# Altium schematic sheet SynchronousBuck.SchDoc
size 500 x 299 mm; SheetNumber: 1; SheetTotal: 1
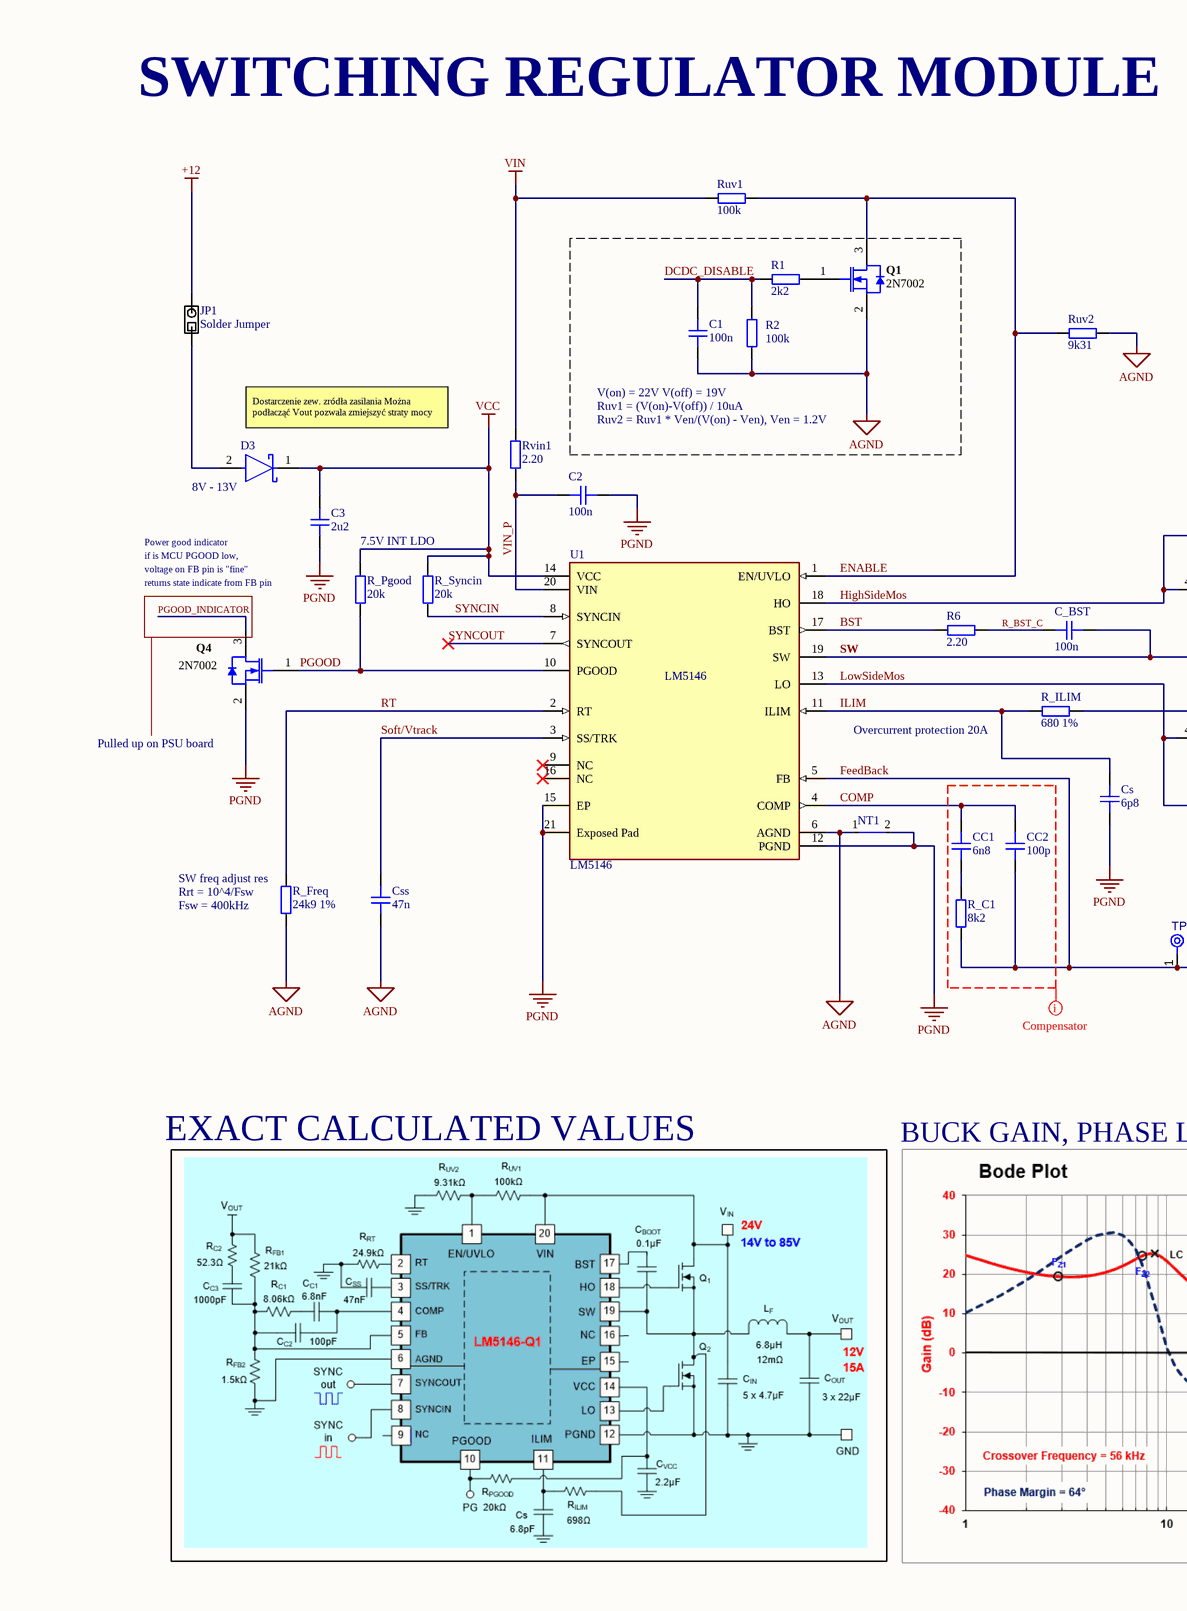
[diagram p0: SynchronousBuck.SchDoc, middle]
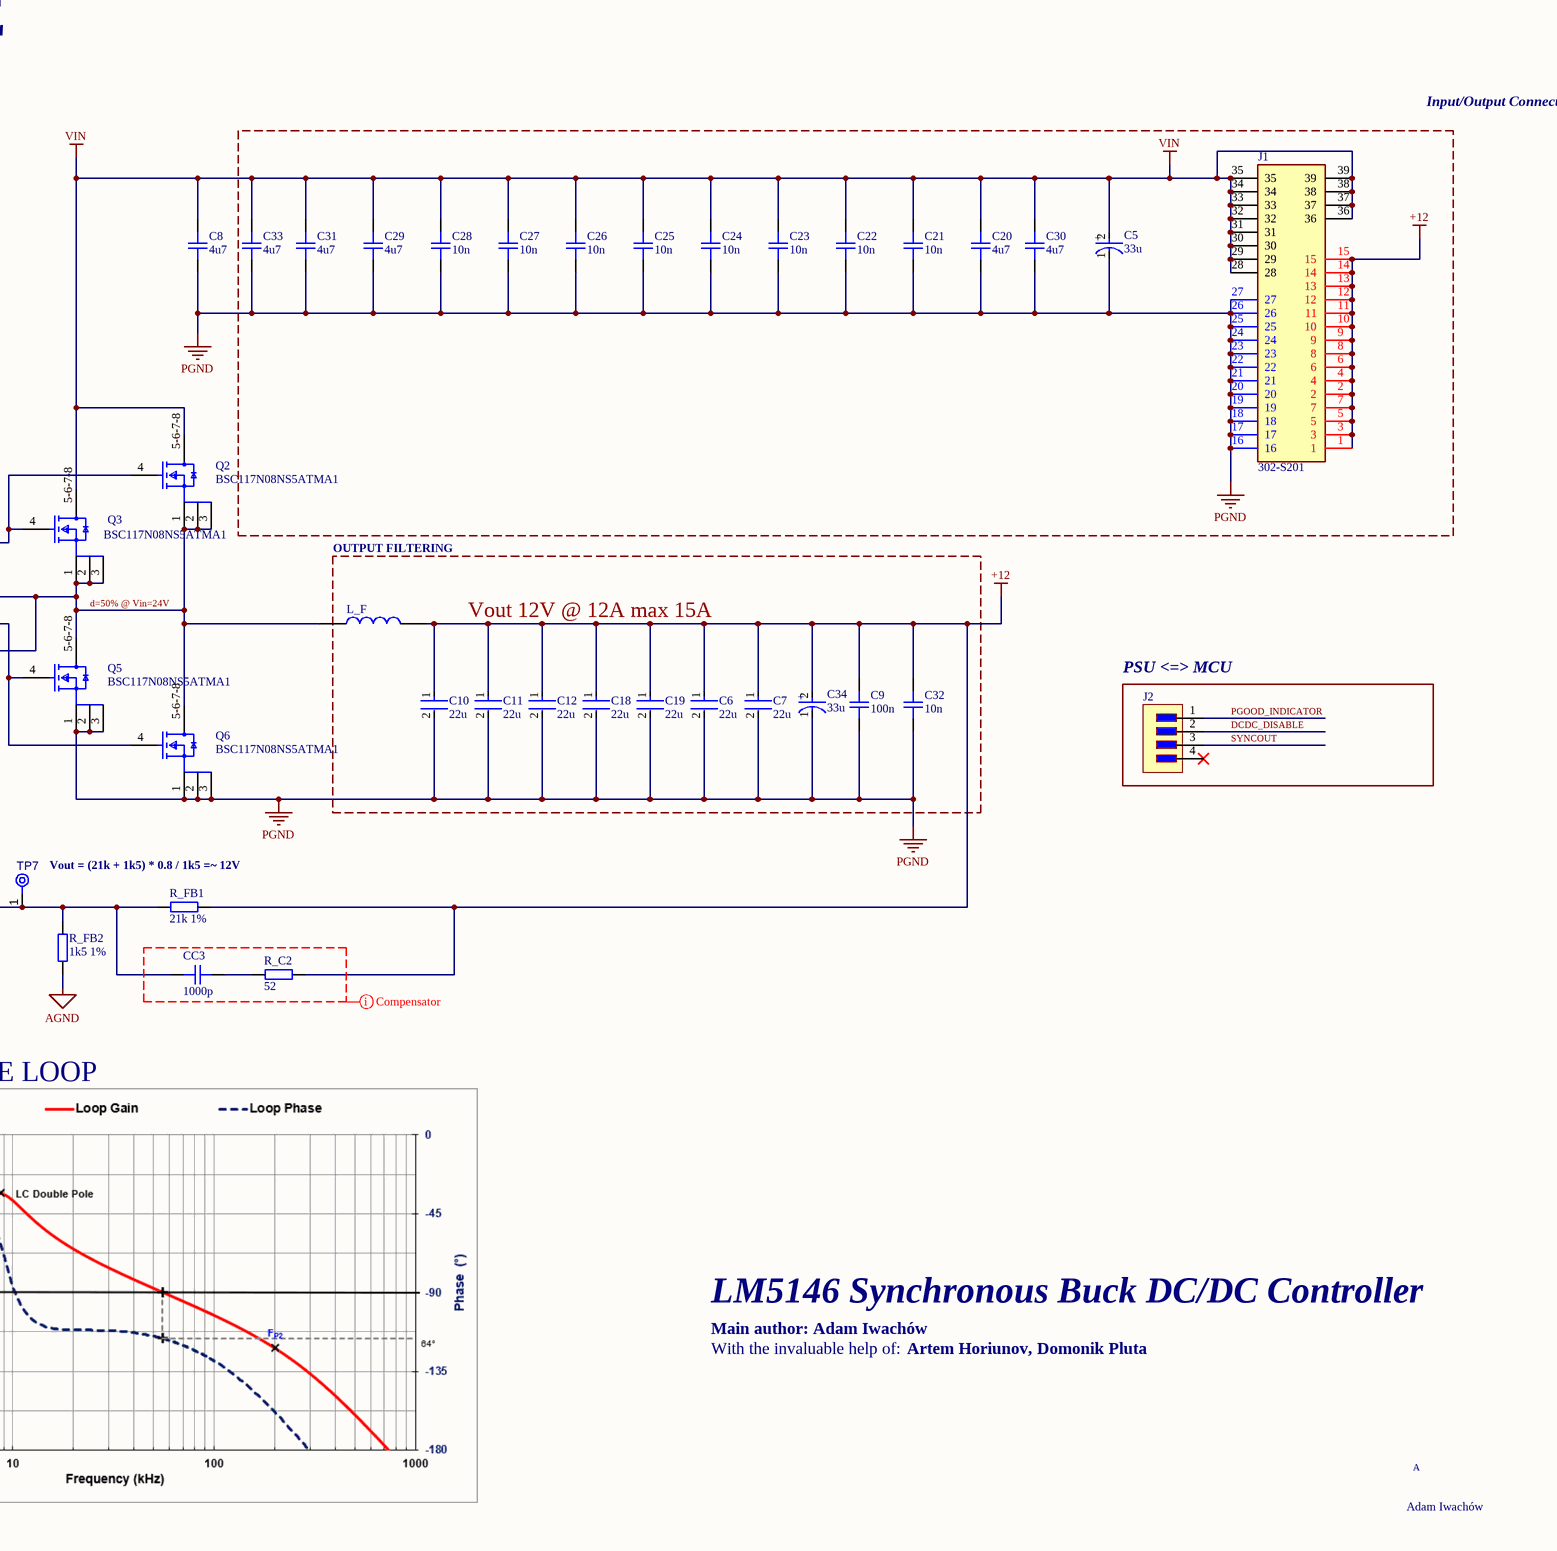
[diagram p1: SynchronousBuck.SchDoc, right]

## Parts
C1  100n  [CAP_0603]
C2  100n  [CAP_0603]
C3  2u2  [CAP_0603]
C5  33u  [FP-FKG-MFG]
C6  22u  [FP-GRM32E-0_3-0_2-MFG]
C7  22u  [FP-GRM32E-0_3-0_2-MFG]
C8  4u7  [CAP_1210]
C9  100n  [CAP_0603]
C10  22u  [FP-GRM32E-0_3-0_2-MFG]
C11  22u  [FP-GRM32E-0_3-0_2-MFG]
C12  22u  [FP-GRM32E-0_3-0_2-MFG]
C18  22u  [FP-GRM32E-0_3-0_2-MFG]
C19  22u  [FP-GRM32E-0_3-0_2-MFG]
C20  4u7  [CAP_1210]
C21  10n  [CAP_0603]
C22  10n  [CAP_0603]
C23  10n  [CAP_0603]
C24  10n  [CAP_0603]
C25  10n  [CAP_0603]
C26  10n  [CAP_0603]
C27  10n  [CAP_0603]
C28  10n  [CAP_0603]
C29  4u7  [CAP_1210]
C30  4u7  [CAP_1210]
C31  4u7  [CAP_1210]
C32  10n  [CAP_0603]
C33  4u7  [CAP_1210]
C34  33u  [FP-FKG-MFG]
C_BST  100n  [CAP_0603]
CC1  6n8  [CAP_0603]
CC2  100p  [CAP_0603]
CC3  1000p  [CAP_0603]
Cs  6p8  [CAP_0603]
Css  47n  [CAP_0603]
D3  BAT41KFILM  [FP-SOD-523-MFG]  (value not drawn)
J1  302-S201  [SHDR20W66P254_2X10_3300X905X905P]
J2  JST_XH_9PIN_254  [JST_XH_9PIN_254]  (value not drawn)
JP1  Solder Jumper  [SolderJumper_Single]
L_F  FEXL1510A-100M  [FEXL1510A-100M]  (value not drawn)
NT1  NT  [Netie]  (value not drawn)
Q1  2N7002  [INF-PG-SOT23_M]
Q2  BSC117N08NS5ATMA1  [FP-PG-TDSON-8-MFG]
Q3  BSC117N08NS5ATMA1  [FP-PG-TDSON-8-MFG]
Q4  2N7002  [INF-PG-SOT23_M]
Q5  BSC117N08NS5ATMA1  [FP-PG-TDSON-8-MFG]
Q6  BSC117N08NS5ATMA1  [FP-PG-TDSON-8-MFG]
R1  2k2  [RES_0603]
R2  100k  [RES_0603]
R6  2.20  [RES_0603]
R_C1  8k2  [RES_0603]
R_C2  52  [RES_0603]
R_FB1  21k 1%  [RES_0603]
R_FB2  1k5 1%  [RES_0603]
R_Freq  24k9 1%  [RES_0603]
R_ILIM  680 1%  [RES_0603]
R_Pgood  20k  [RES_0603]
R_Syncin  20k  [RES_0603]
Ruv1  100k  [RES_0603]
Ruv2  9k31  [RES_0603]
Rvin1  2.20  [RES_0603]
TP7  TPAD6R  [TP06R]  (value not drawn)  (no BOM)
U1  LM5146  [LM5146RGYR]

## Blocks framed on the sheet
Vout 12V @ 12A max 15A: C6 C7 C9-C12 C18 C19 C32 C34 L_F
PSU <=> MCU: J2

## Nets
+12: C6.1 C7.1 C9.2 C10.1 C11.1 C12.1 C18.1 C19.1 C32.2 C34.2(A) J1.1 J1.2 J1.3 J1.4 J1.5 J1.6 J1.7 J1.8 J1.9 J1.10 J1.11 J1.12 J1.13 J1.14 J1.15 JP1.2 L_F.2 R_C2.1 R_FB1.1
AGND: C1.1 Css.1 NT1.1 Q1.2(SOURCE) R2.1 R_FB2.1 R_Freq.1 Ruv2.1 U1.6(AGND)
PGND: C2.2 C3.1 C5.1(C) C6.2 C7.2 C8.1 C9.1 C10.2 C11.2 C12.2 C18.2 C19.2 C20.1 C21.1 C22.1 C23.1 C24.1 C25.1 C26.1 C27.1 C28.1 C29.1 C30.1 C31.1 C32.1 C33.1 C34.1(C) Cs.1 J1.16 J1.17 J1.18 J1.19 J1.20 J1.21 J1.22 J1.23 J1.24 J1.25 J1.26 J1.27 NT1.2 Q4.2(SOURCE) Q5.1(S) Q5.2(S) Q5.3(S) Q6.1(S) Q6.2(S) Q6.3(S) U1.12(PGND) U1.15(EP) U1.21(Exposed_Pad)
VCC: C3.2 D3.1(C) R_Pgood.1 R_Syncin.2 U1.14(VCC)
VIN: C5.2(A) C8.2 C20.2 C21.2 C22.2 C23.2 C24.2 C25.2 C26.2 C27.2 C28.2 C29.2 C30.2 C31.2 C33.2 J1.28 J1.29 J1.30 J1.31 J1.32 J1.33 J1.34 J1.35 J1.36 J1.37 J1.38 J1.39 Q2.5-6-7-8(D) Q3.5-6-7-8(D) Ruv1.2 Rvin1.2
BST: R6.1 U1.17(BST)
COMP: CC1.2 CC2.2 U1.4(COMP)
DCDC_DISABLE: C1.2 J2.2 R1.1 R2.2
ENABLE: Q1.3(DRAIN) Ruv1.1 Ruv2.2 U1.1(EN/UVLO)
FeedBack: CC2.1 CC3.2 R_C1.1 R_FB1.2 R_FB2.2 TP7.1(TP) U1.5(FB)
HighSideMos: Q2.4(G) Q3.4(G) U1.18(HO)
ILIM: Cs.2 R_ILIM.1 U1.11(ILIM)
LowSideMos: Q5.4(G) Q6.4(G) U1.13(LO)
PGOOD: Q4.1(GATE) R_Pgood.2 U1.10(PGOOD)
PGOOD_INDICATOR: J2.1 Q4.3(DRAIN)
R_BST_C: C_BST.1 R6.2
RT: R_Freq.2 U1.2(RT)
Soft/Vtrack: Css.2 U1.3(SS/TRK)
SW: C_BST.2 L_F.1 Q2.1(S) Q2.2(S) Q2.3(S) Q3.1(S) Q3.2(S) Q3.3(S) Q5.5-6-7-8(D) Q6.5-6-7-8(D) R_ILIM.2 U1.19(SW)
SYNCIN: R_Syncin.1 U1.8(SYNCIN)
SYNCOUT: J2.3 U1.7(SYNCOUT)
VIN_P: C2.1 Rvin1.1 U1.20(VIN)
NetCC1_1: CC1.1 R_C1.2
NetCC3_1: CC3.1 R_C2.2
NetD3_2: D3.2(A) JP1.1
NetQ1_1: Q1.1(GATE) R1.2

Not connected (* = marked no-connect by the designer): J2 4*; U1 9(NC)* 16(NC)*

## Layout directives
net class Control Loop: (no net found under the mark)

## Notes on the sheet
- SWITCHING REGULATOR MODULE
- Input/Output Connector
- V(on) = 22V V(off) = 19V
- Ruv1 = (V(on)-V(off)) / 10uA
- (near D3) Dostarczenie zew. zródła zasilania Można podłacząć Vout pozwala zmiejszyć straty mocy
- Ruv2 = Ruv1 * Ven/(V(on) - Ven), Ven = 1.2V
- Power good indicator
- (near D3) 8V - 13V
- 7.5V INT LDO
- returns state indicate from FB pin
- if is MCU PGOOD low,
- voltage on FB pin is "fine"
- OUTPUT FILTERING
- d=50% @ Vin=24V
- Pulled up on PSU board
- Overcurrent protection 20A
- (near R_Freq) SW freq adjust res
- (near R_Freq) Rrt = 10^4/Fsw
- (near R_Freq) Fsw = 400kHz
- Vout = (21k + 1k5) * 0.8 / 1k5 =~ 12V
- EXACT CALCULATED VALUES
- BUCK GAIN, PHASE LOOP
- LM5146 Synchronous Buck DC/DC Controller
- Main author: Adam Iwachów
- With the invaluable help of:
- Artem Horiunov, Domonik Pluta
- A
- Adam Iwachów
- (in symbol CMP-05427-000099-1) +

## Library data of the parts
C1-C3 C9 C21-C23 C25-C28 C32 C_BST CC1-CC3 Cs Css = CAP_0603: Capacitor SMD 0603; Manufacturer: *; Manufacturer Part Number: *; Distributor Link: *; LCSC: *; Rating: *; Dielectric: *
C5 C34 = CMP-05427-000099-1: CAP ALUM 220UF 20% 50V SMD EEE-FK1H221GP; Ripple Current (AC): 670mA; ESR (Equivalent Series Resistance): 180mR; Life (Hours): 5000Hour; Polarity: Polar; Dissipation Factor: 0.1%; Leakage Current: 3uA; Lead Free: Lead Free; Max Operating Temperature: 105°C; Ripple Current: 670mA; Radiation Hardening: No; Width: 12mm; Packaging: Tape and Reel; Voltage: 50V; Capacitance: 220uF; Series: FK; Mount: Surface Mount; Diameter: 10mm; Min Operating Temperature: -55°C; Voltage Rating: 50V; Tolerance: 20%; Length: 10.2mm; Contact Plating: Tin; REACH SVHC: No SVHC; Number of Pins: 2; Construction: Cylindrical; Impedance: 180mR; Termination: SMD/SMT; Voltage Rating (DC): 50V; Height - Seated (Max): 0.413inch; Case/Package: Radial; RoHS Compliant: Yes; Package Quantity: 500; Height: 10.2mm
C6 C7 C10-C12 C18 C19 = CMP-1662-00021-2: Chip Multilayer Ceramic Capacitors for General Purpose, 1210, 22uF, X7R, 15%, 10%, 25V GRM32ER71E226KE15L; Capacitance: 22uF; Lead Free: Lead Free; Depth: 2.5mm; Mount: Surface Mount; Termination: SMD/SMT; Radiation Hardening: No; Package Quantity: 1; Dielectric: X7R; REACH SVHC: No SVHC; Voltage: 25V; Voltage Rating: 25V; Case Code (Metric): 3225; Tolerance: 10%; Number of Pins: 2; Packaging: Tape and Reel; Thickness: 0.106inch; Min Operating Temperature: -55°C; Length: 3.2mm; Voltage Rating (DC): 25V; Width: 0.098inch; Height: 2.5mm; Case Code (Imperial): 1210; Max Operating Temperature: 125°C; Material: Ceramic; Case/Package: 1210
C8 C20 C29-C31 C33 = CAP_1210: Capacitor SMD 1210; Manufacturer: *; Manufacturer Part Number: *; Distributor Link: *; LCSC: *; Rating: *; Dielectric: *
C24 = CAP_0603: Capacitor SMD 0603 GRM188R71H103KA01D; Manufacturer: *; Manufacturer Part Number: *; Distributor Link: *; LCSC: *; Rating: *; Dielectric: *
D3 = CMP-12187-000015-1: DIODE SCHOTTKY 100V 200MA SOD523; Manufacturer: STMicroelectronics; Max Junction Temp: +150°C; Max Surge Forward Current: 1A; Capacitance: 3pF; Peak Reverse Current: 0.1uA; Value: 3pF; Automotive: No; Max Repetitive Reverse Voltage: 100V; Octopart: https://octopart.com/bat41kfilm-stmicroelectronics-658186; Temperature Range High: +150°C; Digikey Description: DIODE SCHOTTKY 100V 200MA SOD523; Device Class L2: Diodes; Forward Current: 200mA; Device Class L1: Discrete Semiconductors; Lead Free: Yes; Temperature: to +150°C; Manufacturer Part Number: BAT41KFILM; Mouser Description: Schottky Diodes & Rectifiers schottky diode; Height: 0.7mm; RoHS: TRUE; ComponentLink2Description: Datasheet; Device Class L3: Schottky Diodes; Category: Diode; Package: SOD-523; ComponentLink2URL: https://www.st.com/resource/en/datasheet/bat41.pdf
J1 = DCDC_INPUT_CONN: Conn Shrouded Header HDR 20 POS 2.54mm Solder ST Thru-Hole; Manufacturer_Name: On Shore Technology Inc.; Geometry.Height: 9.05mm; Manufacturer_Part_Number: 302-S201; Mouser Part Number: *; Mouser Price/Stock: *; Arrow Part Number: 302-S201; Arrow Price/Stock: https://www.arrow.com/en/products/302-s201/on-shore-technology?region=nac; Datasheet Link: https://www.on-shore.com/wp-content/uploads/2018/04/302-SXX1.pdf
JP1 = SolderJumper_Single: Solder Jumper Single 0.5mm Pitch
L_F = FEXL1510A-100M: Wire Wound Moulded SMD Power Inductor; Manufacturer_Name: cjiang(Changjiang Microelectronics Tech); Manufacturer_Part_Number: FXL1360-4R7-M; Geometry.Height: 6mm; Mouser Part Number: *; Mouser Price/Stock: *; Arrow Part Number: *; Arrow Price/Stock: *; Datasheet Link: https://datasheet.lcsc.com/szlcsc/2005061504_cjiang-Changjiang-Microelectronics-Tech-FXL1360-4R7-M_C526021.pdf
NT1 = NetTie: Single point connection between nets
Q1 Q4 = CMP-1149-00026-1: N-Channel OptiMOS Small-Signal-Transistor, 60 V VDS, 0.3 A ID, -55 to 150 degC, PG-SOT23, Reel, Green; Manufacturer: Infineon; RDS (on) (max) (@4.5V): 4,000 mOhm; VDS (max): 60 V; IDpuls (max): 1.2Â A; QG: 0.4Â nC; RDS (on) (max): 3,000 mOhm; RthJA (max): 250 K/W; ID (max): 0.3Â A; VGS(th) (max): 2.5Â V; VGS(th) (min): 1.5Â V; Green: TRUE; Ptot (max): 0.5Â W; PackageDescription: 3-Pin Small Outline Transistor Package, 2.9 x 1.3 mm Body, 0.95 mm Pitch; Halogen-free: TRUE; ComponentLink2Description: Datasheet; ComponentLink1URL: http://www.infineon.com/; Packing: Reel; DatasheetVersion: Rev. 2.4; PartNumber: 2N7002; PackageReference: PG-SOT23; PackageVersion: Apr-08; ComponentLink3URL: http://www.infineon.com/dgdl/SOT23-Package_Overview.pdf?folderId=db3a30431936bc4b0119532290053c66&fileId=db3a30431936bc4b0119533468123c85; ComponentLink1Description: Manufacturer URL; Mounting Technology: Surface Mount; ComponentLink3Description: Package Specification; ComponentLink2URL: http://www.infineon.com/dgdl/2N7002_Rev2.4.pdf?folderId=db3a3043156fd573011622e10b5c1f67&fileId=db3a304319bc939a0119c2a9461e79e6
Q2 Q3 Q5 Q6 = CMP-32901-000078-1: MOSFET N-CH 80V 49A 8TDSON; Manufacturer: Infineon; Reverse Recovery Charge: 45nC; Typ Forward Diode Voltage: 0.9V; Max Forward Diode Voltage: 1.1V; Number Of Channels: 1; Threshold Vgs Max: 3.8V; Continuous Drain Current: 19A; Reverse Recovery Time: 37ns; Threshold Vgs Min: 2.2V; Transconductance: 38S; Pulse Drain Current: 196A; Drain To Source Resistance: 9.6mΩ; Max Junction Temp: +150°C; Input Capacitace At Vds: 1000pF @ 40V; Turn Off Delay Time: 16ns; Depletion Mode: False; Gate To Source Voltage: 20V; Rthja Max: 50K/W; Power Dissipation: 2.5W; Turn On Delay Time: 10ns; Gate Charge At Vgs: 15nC @ 10V; Manufacturer Part Number: BSC117N08NS5ATMA1; Octopart: https://octopart.com/bsc117n08ns5atma1-infineon-52825716; Package: PG-TDSON-8; Lead Free: Yes; ComponentLink2Description: Datasheet; RoHS: TRUE; Digikey Description: MOSFET N-CH 80V 49A 8TDSON; Drain To Source Voltage: 80V; Category: Trans; Number Of N Channels: 1; Temperature: -55°C to +150°C; Device Class L1: Discrete Semiconductors; ComponentLink2URL: https://www.infineon.com/dgdl/Infineon-BSC117N08NS5-DS-v02_00-EN.pdf?fileId=5546d4624ad04ef9014ae97632721c1b; Temperature Range Low: -55°C; Device Class L2: Transistors; Footprint Url: https://www.infineon.com/cms/en/product/packages/PG-TDSON/PG-TDSON-8-7/; Mouser Description: MOSFET N-Ch 80V 49A TDSON-8; Drain To Source Breakdown Voltage: 80V; Device Class L3: MOSFETs; Temperature Range High: +150°C; Height: 1.1mm; Automotive: No
R1 R2 R6 R_C1 R_C2 R_FB1 R_FB2 R_Freq R_ILIM R_Pgood R_Syncin Ruv1 Ruv2 Rvin1 = RES_0603: Resistor SMD 0603; Manufacturer: *; Manufacturer Part Number: *; Distributor Link: *; LCSC: *
TP7 = CMP-00028-00002-2: 0.6mm round; Pins: 1